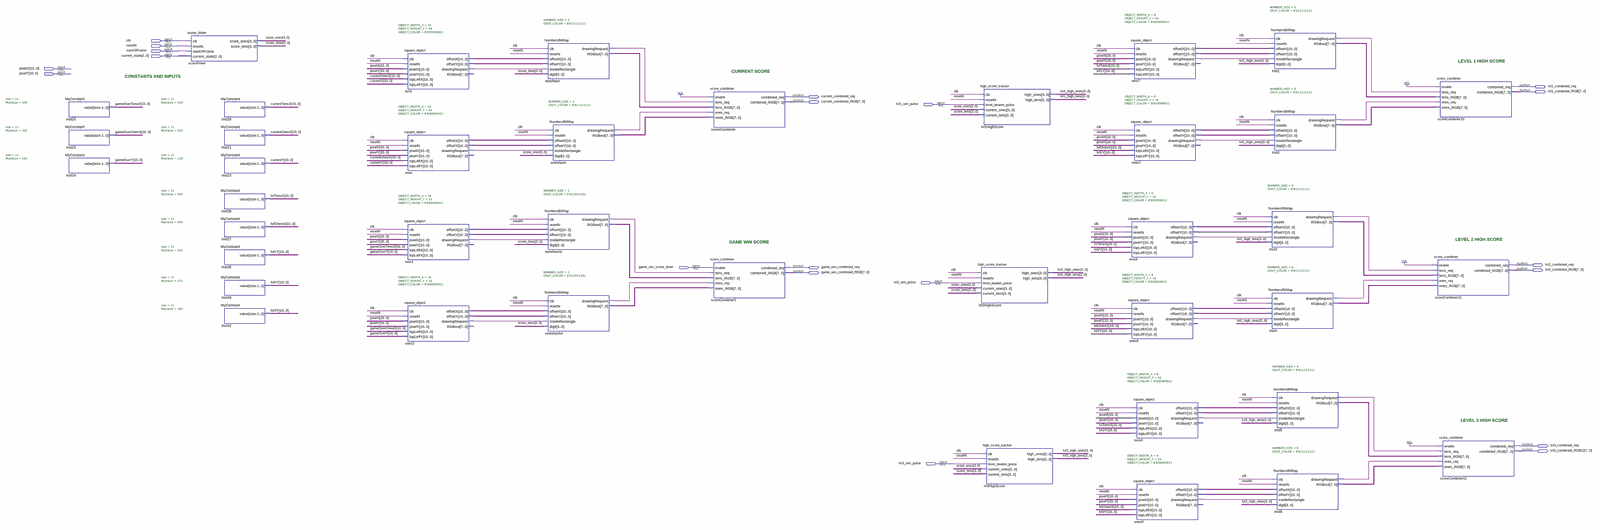
[diagram p0: schematic sheet, whole]
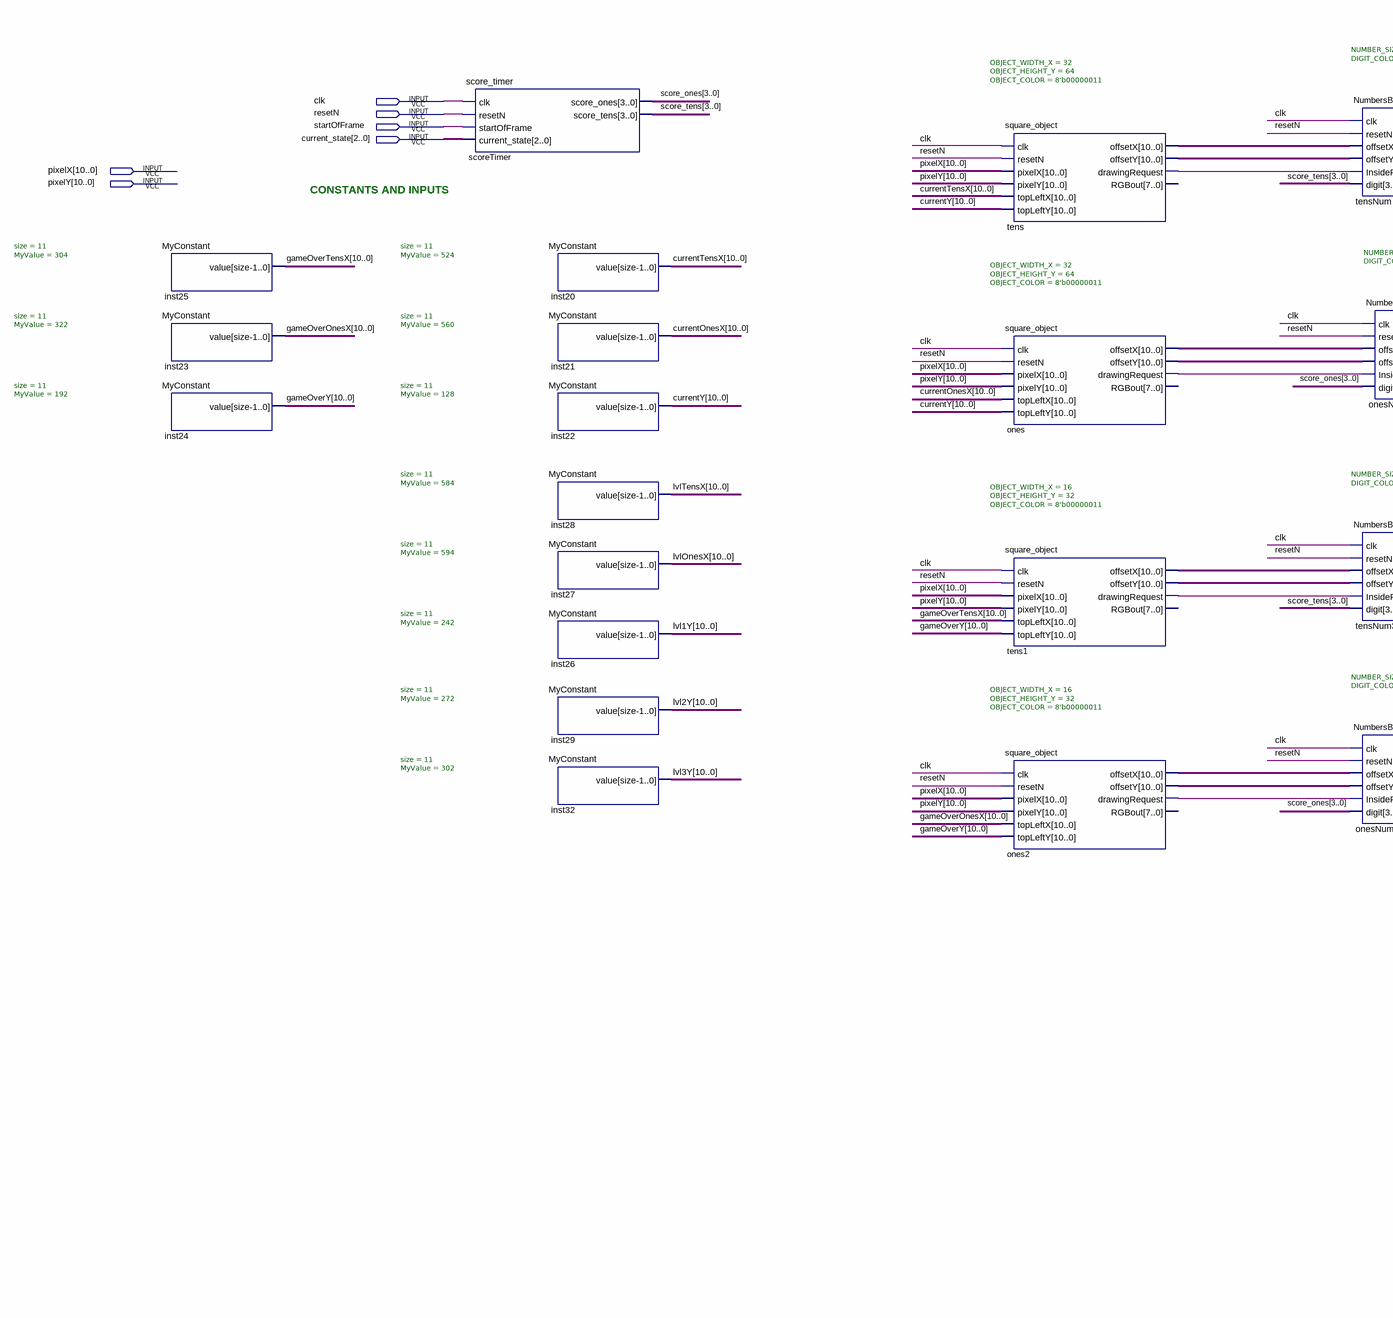
[diagram p1: schematic sheet, left part]
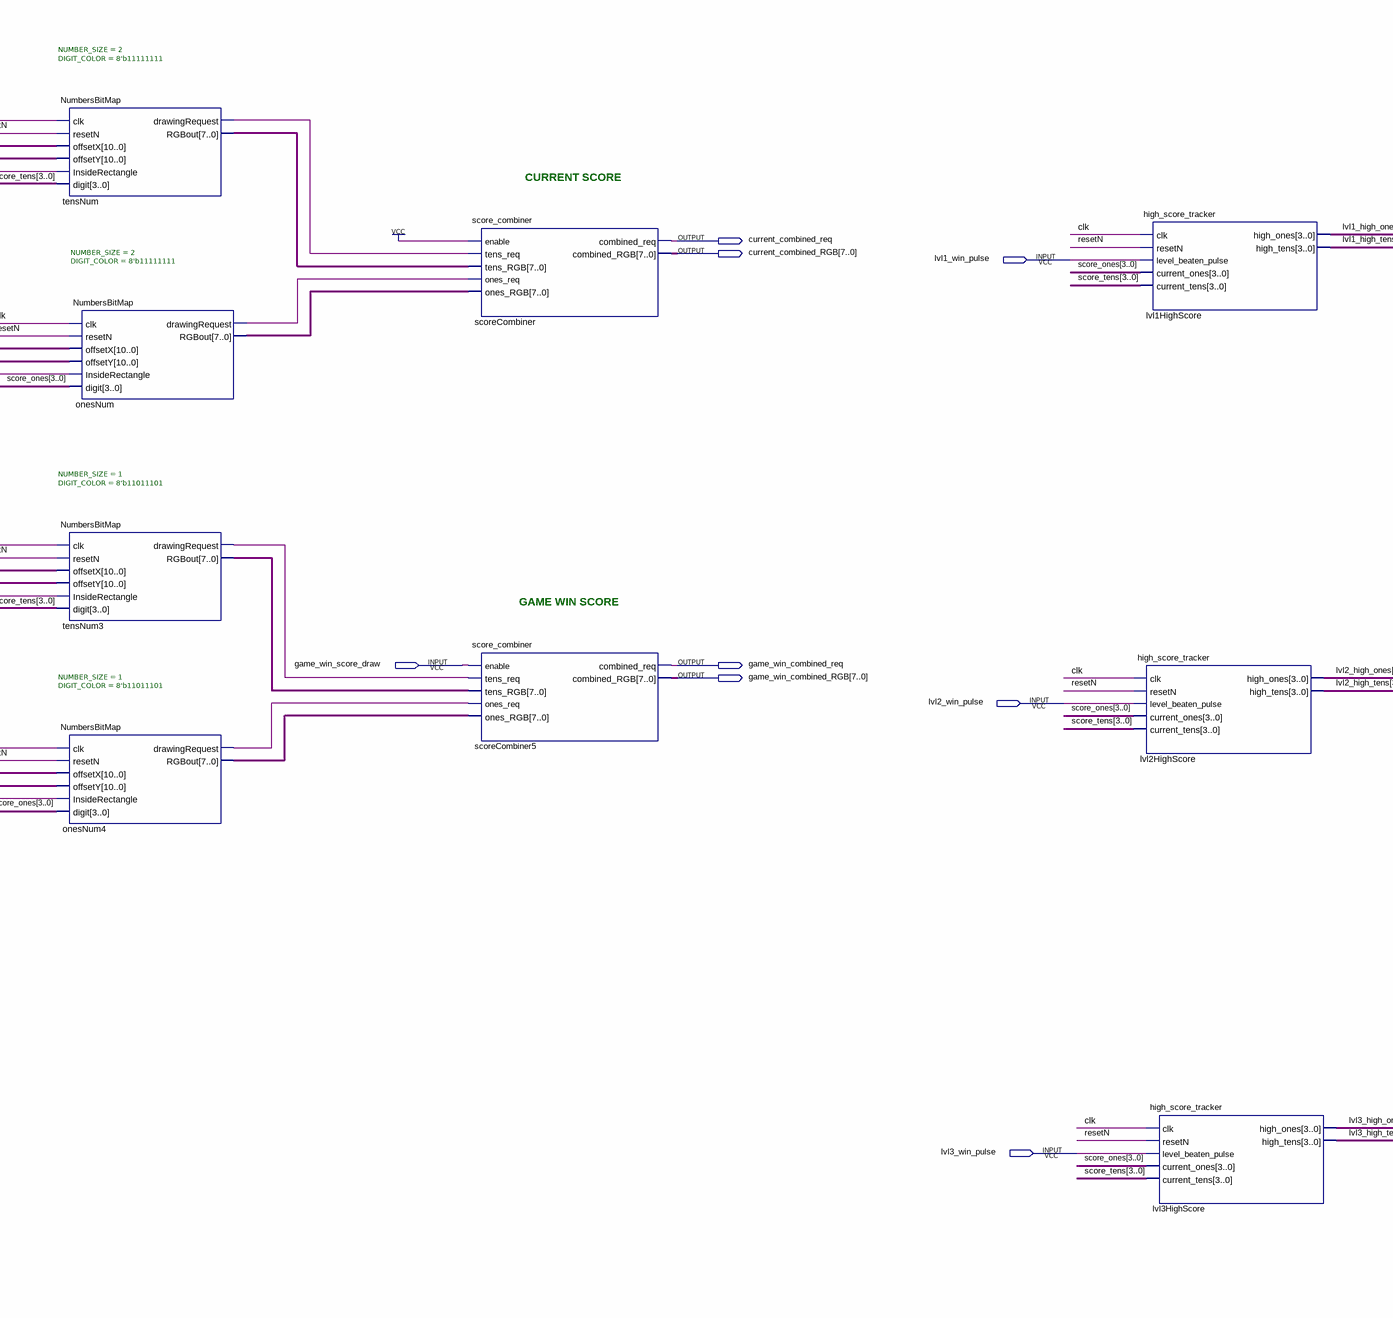
[diagram p2: schematic sheet, centre part]
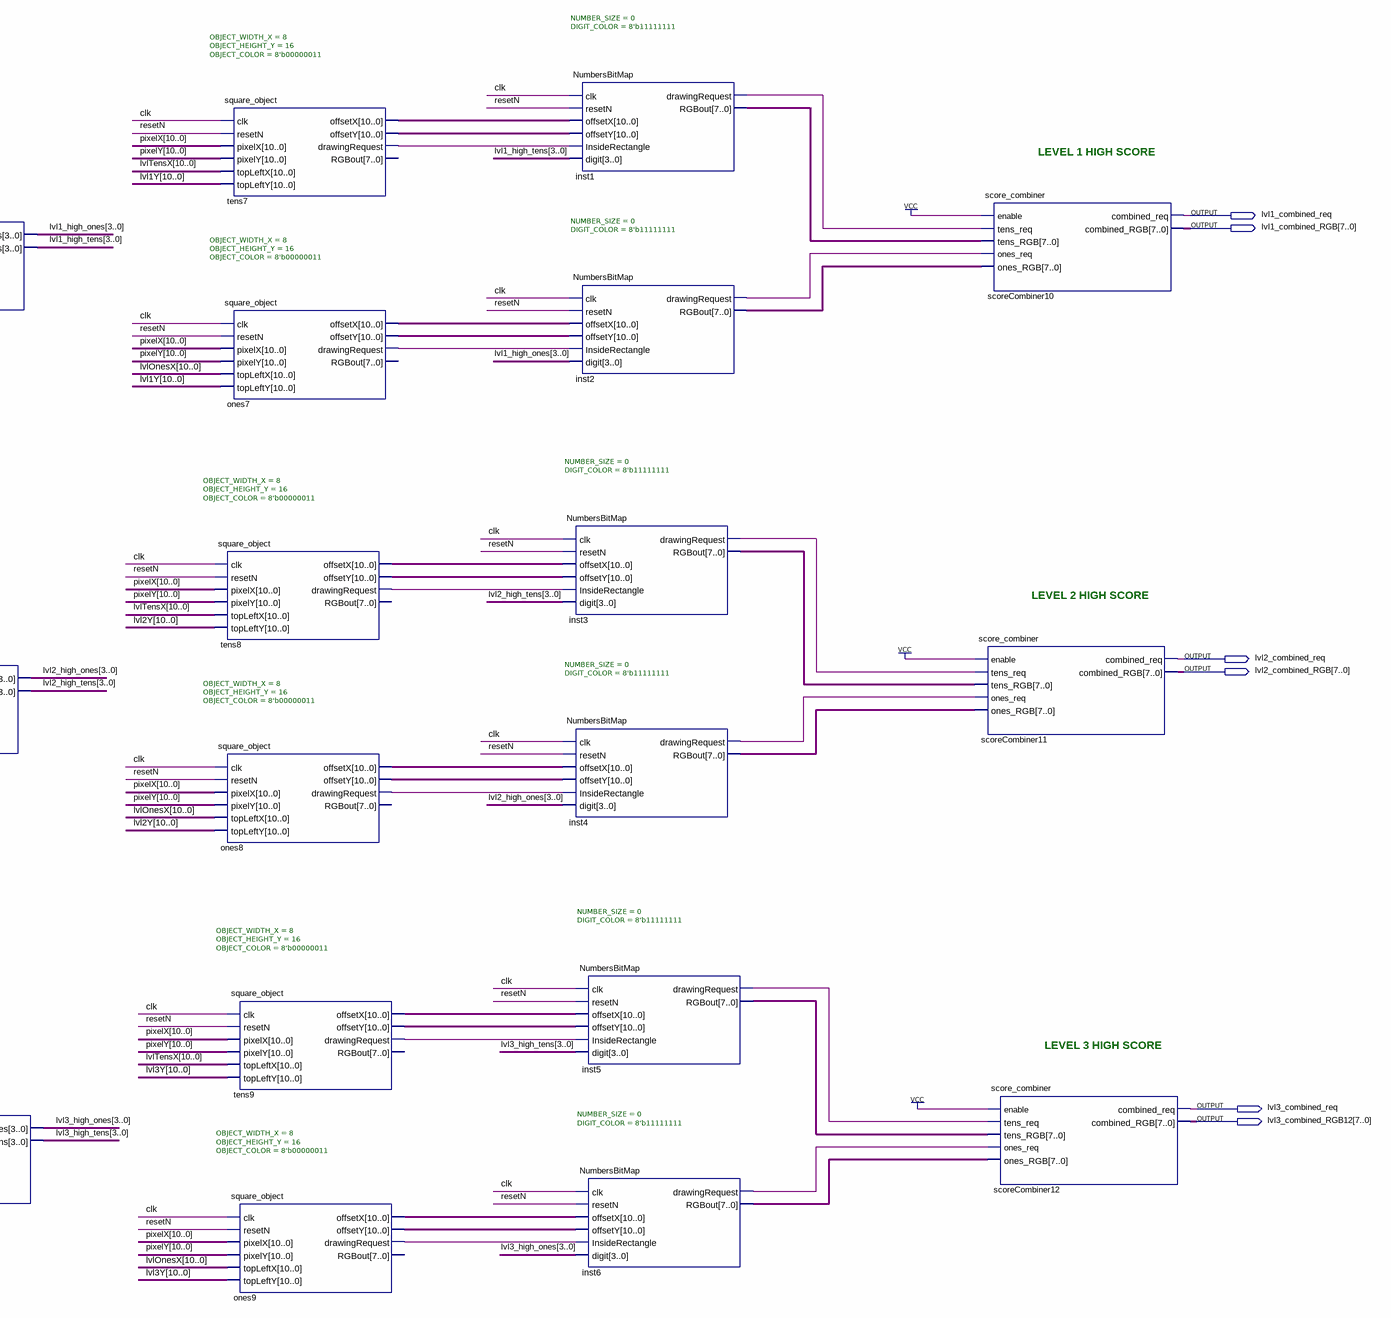
[diagram p3: schematic sheet, right part]
// Quartus schematic Score_Display.bdf as structural Verilog: 40 symbols, 20 pins
module Score_Display (
  input  clk,
  input  resetN,
  input  startOfFrame,
  input  [2:0] current_state,
  input  [10:0] pixelX,
  input  [10:0] pixelY,
  input  lvl1_win_pulse,
  input  game_win_score_draw,
  input  lvl2_win_pulse,
  input  lvl3_win_pulse,
  output lvl1_combined_req,
  output [7:0] lvl1_combined_RGB,
  output current_combined_req,
  output [7:0] current_combined_RGB,
  output lvl2_combined_req,
  output game_win_combined_req,
  output [7:0] lvl2_combined_RGB,
  output [7:0] game_win_combined_RGB,
  output lvl3_combined_req,
  output [7:0] lvl3_combined_RGB12
);

  wire inst1_drawingrequest, inst2_drawingrequest, inst3_drawingrequest, inst4_drawingrequest,
       inst5_drawingrequest, inst6_drawingrequest, ones2_drawingrequest, ones7_drawingrequest,
       ones8_drawingrequest, ones9_drawingrequest, ones_drawingrequest, onesNum4_drawingrequest,
       onesNum_drawingrequest, tens1_drawingrequest, tens7_drawingrequest, tens8_drawingrequest,
       tens9_drawingrequest, tens_drawingrequest, tensNum3_drawingrequest, tensNum_drawingrequest;
  wire [3:0] lvl1_high_ones, lvl1_high_tens, lvl2_high_ones, lvl2_high_tens, lvl3_high_ones, lvl3_high_tens,
       score_ones, score_tens;
  wire [7:0] inst1_rgbout, inst2_rgbout, inst3_rgbout, inst4_rgbout, inst5_rgbout, inst6_rgbout,
       onesNum4_rgbout, onesNum_rgbout, tensNum3_rgbout, tensNum_rgbout;
  wire [10:0] currentOnesX, currentTensX, currentY, gameOverOnesX, gameOverTensX, gameOverY, lvl1Y, lvl2Y,
       lvl3Y, lvlOnesX, lvlTensX, ones2_offsetx, ones2_offsety, ones7_offsetx, ones7_offsety, ones8_offsetx,
       ones8_offsety, ones9_offsetx, ones9_offsety, ones_offsetx, ones_offsety, tens1_offsetx, tens1_offsety,
       tens7_offsetx, tens7_offsety, tens8_offsetx, tens8_offsety, tens9_offsetx, tens9_offsety,
       tens_offsetx, tens_offsety;

  MyConstant #(.size(11), .MyValue(304)) inst25 (.value(gameOverTensX));
  MyConstant #(.size(11), .MyValue(322)) inst23 (.value(gameOverOnesX));
  MyConstant #(.size(11), .MyValue(192)) inst24 (.value(gameOverY));
  score_timer scoreTimer (
    .clk(clk), .resetN(resetN), .startOfFrame(startOfFrame), .current_state(current_state),
    .score_ones(score_ones), .score_tens(score_tens));
  MyConstant #(.size(11), .MyValue(524)) inst20 (.value(currentTensX));
  MyConstant #(.size(11), .MyValue(560)) inst21 (.value(currentOnesX));
  MyConstant #(.size(11), .MyValue(128)) inst22 (.value(currentY));
  MyConstant #(.size(11), .MyValue(584)) inst28 (.value(lvlTensX));
  MyConstant #(.size(11), .MyValue(594)) inst27 (.value(lvlOnesX));
  MyConstant #(.size(11), .MyValue(242)) inst26 (.value(lvl1Y));
  MyConstant #(.size(11), .MyValue(272)) inst29 (.value(lvl2Y));
  MyConstant #(.size(11), .MyValue(302)) inst32 (.value(lvl3Y));
  square_object #(.OBJECT_WIDTH_X(32), .OBJECT_HEIGHT_Y(64), .OBJECT_COLOR(8'b00000011)) tens (
    .clk(clk), .resetN(resetN), .pixelX(pixelX), .pixelY(pixelY), .topLeftX(currentTensX),
    .topLeftY(currentY), .offsetX(tens_offsetx), .offsetY(tens_offsety), .drawingRequest(tens_drawingrequest));  // open: RGBout
  square_object #(.OBJECT_WIDTH_X(32), .OBJECT_HEIGHT_Y(64), .OBJECT_COLOR(8'b00000011)) ones (
    .clk(clk), .resetN(resetN), .pixelX(pixelX), .pixelY(pixelY), .topLeftX(currentOnesX),
    .topLeftY(currentY), .offsetX(ones_offsetx), .offsetY(ones_offsety), .drawingRequest(ones_drawingrequest));  // open: RGBout
  square_object #(.OBJECT_WIDTH_X(16), .OBJECT_HEIGHT_Y(32), .OBJECT_COLOR(8'b00000011)) tens1 (
    .clk(clk), .resetN(resetN), .pixelX(pixelX), .pixelY(pixelY), .topLeftX(gameOverTensX),
    .topLeftY(gameOverY), .offsetX(tens1_offsetx), .offsetY(tens1_offsety),
    .drawingRequest(tens1_drawingrequest));  // open: RGBout
  square_object #(.OBJECT_WIDTH_X(16), .OBJECT_HEIGHT_Y(32), .OBJECT_COLOR(8'b00000011)) ones2 (
    .clk(clk), .resetN(resetN), .pixelX(pixelX), .pixelY(pixelY), .topLeftX(gameOverOnesX),
    .topLeftY(gameOverY), .offsetX(ones2_offsetx), .offsetY(ones2_offsety),
    .drawingRequest(ones2_drawingrequest));  // open: RGBout
  NumbersBitMap #(.NUMBER_SIZE(2), .DIGIT_COLOR(8'b11111111)) tensNum (
    .clk(clk), .resetN(resetN), .offsetX(tens_offsetx), .offsetY(tens_offsety),
    .InsideRectangle(tens_drawingrequest), .digit(score_tens), .drawingRequest(tensNum_drawingrequest),
    .RGBout(tensNum_rgbout));
  NumbersBitMap #(.NUMBER_SIZE(2), .DIGIT_COLOR(8'b11111111)) onesNum (
    .clk(clk), .resetN(resetN), .offsetX(ones_offsetx), .offsetY(ones_offsety),
    .InsideRectangle(ones_drawingrequest), .digit(score_ones), .drawingRequest(onesNum_drawingrequest),
    .RGBout(onesNum_rgbout));
  NumbersBitMap #(.NUMBER_SIZE(1), .DIGIT_COLOR(8'b11011101)) tensNum3 (
    .clk(clk), .resetN(resetN), .offsetX(tens1_offsetx), .offsetY(tens1_offsety),
    .InsideRectangle(tens1_drawingrequest), .digit(score_tens), .drawingRequest(tensNum3_drawingrequest),
    .RGBout(tensNum3_rgbout));
  NumbersBitMap #(.NUMBER_SIZE(1), .DIGIT_COLOR(8'b11011101)) onesNum4 (
    .clk(clk), .resetN(resetN), .offsetX(ones2_offsetx), .offsetY(ones2_offsety),
    .InsideRectangle(ones2_drawingrequest), .digit(score_ones), .drawingRequest(onesNum4_drawingrequest),
    .RGBout(onesNum4_rgbout));
  score_combiner scoreCombiner (
    .enable(1'b1), .tens_req(tensNum_drawingrequest), .tens_RGB(tensNum_rgbout),
    .ones_req(onesNum_drawingrequest), .ones_RGB(onesNum_rgbout), .combined_req(current_combined_req),
    .combined_RGB(current_combined_RGB));
  score_combiner scoreCombiner5 (
    .enable(game_win_score_draw), .tens_req(tensNum3_drawingrequest), .tens_RGB(tensNum3_rgbout),
    .ones_req(onesNum4_drawingrequest), .ones_RGB(onesNum4_rgbout), .combined_req(game_win_combined_req),
    .combined_RGB(game_win_combined_RGB));
  high_score_tracker lvl1HighScore (
    .clk(clk), .resetN(resetN), .level_beaten_pulse(lvl1_win_pulse), .current_ones(score_ones),
    .current_tens(score_tens), .high_ones(lvl1_high_ones), .high_tens(lvl1_high_tens));
  high_score_tracker lvl2HighScore (
    .clk(clk), .resetN(resetN), .level_beaten_pulse(lvl2_win_pulse), .current_ones(score_ones),
    .current_tens(score_tens), .high_ones(lvl2_high_ones), .high_tens(lvl2_high_tens));
  high_score_tracker lvl3HighScore (
    .clk(clk), .resetN(resetN), .level_beaten_pulse(lvl3_win_pulse), .current_ones(score_ones),
    .current_tens(score_tens), .high_ones(lvl3_high_ones), .high_tens(lvl3_high_tens));
  square_object #(.OBJECT_WIDTH_X(8), .OBJECT_HEIGHT_Y(16), .OBJECT_COLOR(8'b00000011)) tens7 (
    .clk(clk), .resetN(resetN), .pixelX(pixelX), .pixelY(pixelY), .topLeftX(lvlTensX), .topLeftY(lvl1Y),
    .offsetX(tens7_offsetx), .offsetY(tens7_offsety), .drawingRequest(tens7_drawingrequest));  // open: RGBout
  square_object #(.OBJECT_WIDTH_X(8), .OBJECT_HEIGHT_Y(16), .OBJECT_COLOR(8'b00000011)) ones7 (
    .clk(clk), .resetN(resetN), .pixelX(pixelX), .pixelY(pixelY), .topLeftX(lvlOnesX), .topLeftY(lvl1Y),
    .offsetX(ones7_offsetx), .offsetY(ones7_offsety), .drawingRequest(ones7_drawingrequest));  // open: RGBout
  square_object #(.OBJECT_WIDTH_X(8), .OBJECT_HEIGHT_Y(16), .OBJECT_COLOR(8'b00000011)) tens8 (
    .clk(clk), .resetN(resetN), .pixelX(pixelX), .pixelY(pixelY), .topLeftX(lvlTensX), .topLeftY(lvl2Y),
    .offsetX(tens8_offsetx), .offsetY(tens8_offsety), .drawingRequest(tens8_drawingrequest));  // open: RGBout
  square_object #(.OBJECT_WIDTH_X(8), .OBJECT_HEIGHT_Y(16), .OBJECT_COLOR(8'b00000011)) ones8 (
    .clk(clk), .resetN(resetN), .pixelX(pixelX), .pixelY(pixelY), .topLeftX(lvlOnesX), .topLeftY(lvl2Y),
    .offsetX(ones8_offsetx), .offsetY(ones8_offsety), .drawingRequest(ones8_drawingrequest));  // open: RGBout
  square_object #(.OBJECT_WIDTH_X(8), .OBJECT_HEIGHT_Y(16), .OBJECT_COLOR(8'b00000011)) tens9 (
    .clk(clk), .resetN(resetN), .pixelX(pixelX), .pixelY(pixelY), .topLeftX(lvlTensX), .topLeftY(lvl3Y),
    .offsetX(tens9_offsetx), .offsetY(tens9_offsety), .drawingRequest(tens9_drawingrequest));  // open: RGBout
  square_object #(.OBJECT_WIDTH_X(8), .OBJECT_HEIGHT_Y(16), .OBJECT_COLOR(8'b00000011)) ones9 (
    .clk(clk), .resetN(resetN), .pixelX(pixelX), .pixelY(pixelY), .topLeftX(lvlOnesX), .topLeftY(lvl3Y),
    .offsetX(ones9_offsetx), .offsetY(ones9_offsety), .drawingRequest(ones9_drawingrequest));  // open: RGBout
  NumbersBitMap #(.NUMBER_SIZE(0), .DIGIT_COLOR(8'b11111111)) inst1 (
    .clk(clk), .resetN(resetN), .offsetX(tens7_offsetx), .offsetY(tens7_offsety),
    .InsideRectangle(tens7_drawingrequest), .digit(lvl1_high_tens), .drawingRequest(inst1_drawingrequest),
    .RGBout(inst1_rgbout));
  NumbersBitMap #(.NUMBER_SIZE(0), .DIGIT_COLOR(8'b11111111)) inst2 (
    .clk(clk), .resetN(resetN), .offsetX(ones7_offsetx), .offsetY(ones7_offsety),
    .InsideRectangle(ones7_drawingrequest), .digit(lvl1_high_ones), .drawingRequest(inst2_drawingrequest),
    .RGBout(inst2_rgbout));
  NumbersBitMap #(.NUMBER_SIZE(0), .DIGIT_COLOR(8'b11111111)) inst3 (
    .clk(clk), .resetN(resetN), .offsetX(tens8_offsetx), .offsetY(tens8_offsety),
    .InsideRectangle(tens8_drawingrequest), .digit(lvl2_high_tens), .drawingRequest(inst3_drawingrequest),
    .RGBout(inst3_rgbout));
  NumbersBitMap #(.NUMBER_SIZE(0), .DIGIT_COLOR(8'b11111111)) inst4 (
    .clk(clk), .resetN(resetN), .offsetX(ones8_offsetx), .offsetY(ones8_offsety),
    .InsideRectangle(ones8_drawingrequest), .digit(lvl2_high_ones), .drawingRequest(inst4_drawingrequest),
    .RGBout(inst4_rgbout));
  NumbersBitMap #(.NUMBER_SIZE(0), .DIGIT_COLOR(8'b11111111)) inst5 (
    .clk(clk), .resetN(resetN), .offsetX(tens9_offsetx), .offsetY(tens9_offsety),
    .InsideRectangle(tens9_drawingrequest), .digit(lvl3_high_tens), .drawingRequest(inst5_drawingrequest),
    .RGBout(inst5_rgbout));
  NumbersBitMap #(.NUMBER_SIZE(0), .DIGIT_COLOR(8'b11111111)) inst6 (
    .clk(clk), .resetN(resetN), .offsetX(ones9_offsetx), .offsetY(ones9_offsety),
    .InsideRectangle(ones9_drawingrequest), .digit(lvl3_high_ones), .drawingRequest(inst6_drawingrequest),
    .RGBout(inst6_rgbout));
  score_combiner scoreCombiner10 (
    .enable(1'b1), .tens_req(inst1_drawingrequest), .tens_RGB(inst1_rgbout), .ones_req(inst2_drawingrequest),
    .ones_RGB(inst2_rgbout), .combined_req(lvl1_combined_req), .combined_RGB(lvl1_combined_RGB));
  score_combiner scoreCombiner11 (
    .enable(1'b1), .tens_req(inst3_drawingrequest), .tens_RGB(inst3_rgbout), .ones_req(inst4_drawingrequest),
    .ones_RGB(inst4_rgbout), .combined_req(lvl2_combined_req), .combined_RGB(lvl2_combined_RGB));
  score_combiner scoreCombiner12 (
    .enable(1'b1), .tens_req(inst5_drawingrequest), .tens_RGB(inst5_rgbout), .ones_req(inst6_drawingrequest),
    .ones_RGB(inst6_rgbout), .combined_req(lvl3_combined_req), .combined_RGB(lvl3_combined_RGB12));

  // Notes on the sheet:
  //   LEVEL 1 HIGH SCORE
  //   CURRENT SCORE 
  //   CONSTANTS AND INPUTS
  //   LEVEL 2 HIGH SCORE
  //   GAME WIN SCORE 
  //   LEVEL 3 HIGH SCORE
endmodule
